# EAGLE schematic MAX31850K-breakout_1.0 (EAGLE 6.6.0)
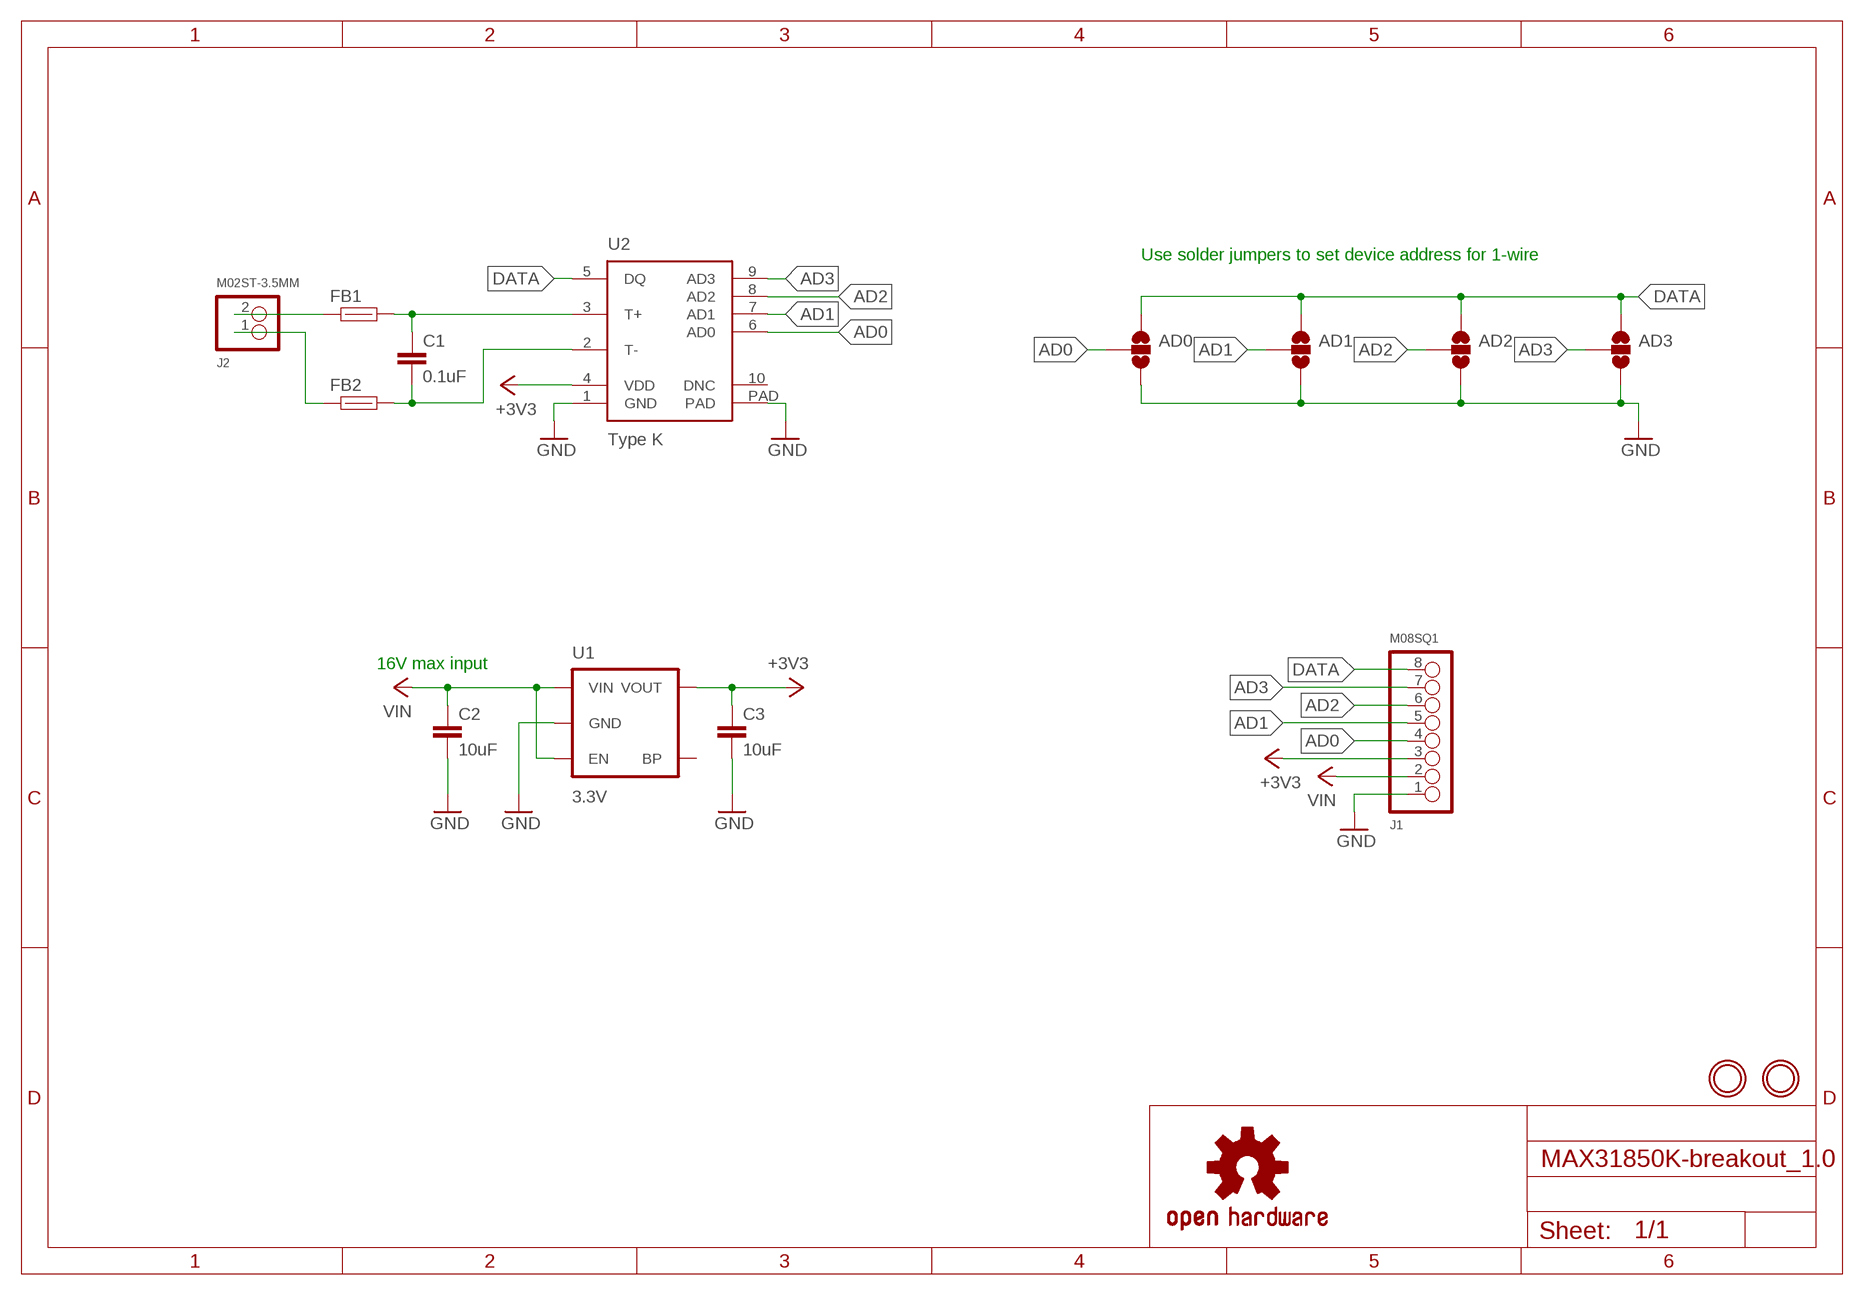
[diagram p0: schematic, sheet 1]

## Parts
AD0  SJ_2WAYS  [SJ_3]
AD1  SJ_2WAYS  [SJ_3]
AD2  SJ_2WAYS  [SJ_3]
AD3  SJ_2WAYS  [SJ_3]
C1  0.1uF  0.1UF-16V-0603  [0603-CAP]
C2  10uF  10UF-35V-1206  [1206-CAP]
C3  10uF  10UF-6.3V-0805  [0805-CAP]
FB1  FB-1K-100MHZ-0603  [0603-RES]
FB2  FB-1K-100MHZ-0603  [0603-RES]
J1  M08SQ1  [1X08_SQ1]
J2  M02ST-3.5MM  [SCREWTERMINAL-3.5MM-2]
LOGO1  OSHW-LOGOM  [OSHW-LOGO-M]
U1  3.3V  LP2985-33DBVR  [SOT23-5]
U2  Type K  MAX31850K  [10-TDFN-EP]
U$1  MNTHOLE-2.0  [MOUNTINGHOLE_2.0_PLATED]
U$2  MNTHOLE-2.0  [MOUNTINGHOLE_2.0_PLATED]

## Nets
+3V3: C3.P$1 J1.3 U1.5(VOUT) U2.4(VDD)
AD0: AD0.2 J1.4 U2.6(AD0)
AD1: AD1.2 J1.5 U2.7(AD1)
AD2: AD2.2 J1.6 U2.8(AD2)
AD3: AD3.2 J1.7 U2.9(AD3)
DATA: AD0.1 AD1.1 AD2.1 AD3.1 J1.8 U2.5(DQ)
GND: AD0.3 AD1.3 AD2.3 AD3.3 C2.P$4 C3.P$2 J1.1 U1.2(GND) U2.1(GND) U2.PAD
TM_FILT: C1.P$2 FB2.P$2 U2.2(T-)
TM_RAW: FB2.P$1 J2.1
TP_FILT: C1.P$1 FB1.P$2 U2.3(T+)
TP_RAW: FB1.P$1 J2.2
VIN: C2.P$3 J1.2 U1.1(VIN) U1.3(EN)
Unconnected: U1.4(BP) U2.10(DNC)

## Notes on the sheet
- Use solder jumpers to set device address for 1-wire
- 16V max input

## Library data of the parts
AD0 AD1-AD3 = LoganSmith-Connectors:SJ_2WAY: Solder Jumper 2 way solder jumper
C1 = LoganSmith-Capacitors:0.1UF-*-?: 0.1uF ceramic capacitors; DIGIKEY_OC: 1276-1005-1-ND; MFR: Samsung Electro-Mechanics America, Inc; MPN: CL10B104KO8NNNC; TEMP_COEFF: X7R; TEMP_RANGE: -55C to 125C; THICK: 0.90mm; TOL: +/-10%
C2 = LoganSmith-Capacitors:10UF-*-?; DIGIKEY_OC: 1276-3103-1-ND; MFR: Samsung Electro-Mechanics America, Inc; MPN: CL31B106KLHNNNE; TEMP_COEFF: X7R; TEMP_RANGE: -55C to 125C; THICK: 1.80mm; TOL: +/-10%
C3 = LoganSmith-Capacitors:10UF-*-?; DIGIKEY_OC: 1276-1113-1-ND; MFR: Samsung Electro-Mechanics America, Inc; MPN: CL21B106KQQNNNE; TEMP_COEFF: X7R; TEMP_RANGE: -55C to 125C; THICK: 1.40mm; TOL: +/-10%
FB1 FB2 = LoganSmith-Inductors:FB-1K-100MHZ-?: 1k@100MHz ferrite bead; CURRENT_RATING: 250mA; DC_RES: 600mOhm(max); DIGIKEY_OC: 1276-6378-1-ND; MFR: Samsung Electro-Mechanics America, Inc.; MPN: CIM10J102NC; THICK: 0.95mm; VALUE: 1kOhm@100MHz
J1 = LoganSmith-Connectors:M08?: 1x8 Headers
J2 = LoganSmith-Connectors:M02?: 1x2 Headers
LOGO1 = SparkFun-Aesthetics:OSHW-LOGO: Open Source Hardware Logo This logo indicates the piece of hardware it is found on incorporates a OSHW license and/or adheres to the definition of open source hardware found here: http://freedomdefined.org/OSHW
U1 = LoganSmith-Power_IC:LP2985*-?: Fixed output Texas Instruments LDO Datasheet <http://www.ti.com/lit/ds/symlink/lp2985-18.pdf> Features Output Tolerance of 1% (A Grade) 1.5% (Standard Grade) Ultra-Low Dropout, Typically 280 mV at Full Load of 150 mA 7 mV at 1 mA Wide VIN Range: 16 V Max; DIGIKEY_OC: 296-18476-1-ND; MFR: Texas Instruments; MPN: LP2985-33DBVR; TEMP_RANGE: -40C to 125C
U2 = LoganSmith-Analog_IC:MAX3185?*: Cold-Junction Compensated, 1-Wire Thermocouple-to-Digital Converters Datasheet <http://datasheets.maximintegrated.com/en/ds/MAX31850-MAX31851.pdf>; DIGIKEY_OC: MAX31850KATB+-ND; MFR: Maxim Integrated; MPN: MAX31850KATB+
U$1 U$2 = LoganSmith-Electromechanical:MNTHOLE-?